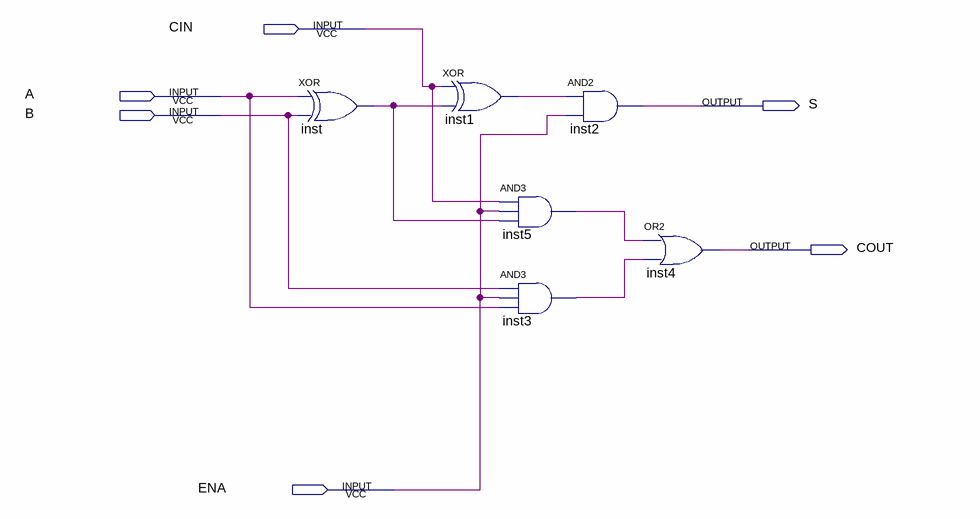
[diagram p0: schematic sheet]
// Quartus schematic FULL_ADDER_1BIT.bdf as structural Verilog: 6 symbols, 6 pins
module FULL_ADDER_1BIT (
  input  CIN,
  input  A,
  input  B,
  input  ENA,
  output S,
  output COUT
);

  wire inst1_out, inst3_out, inst5_out, inst_out;

  xor inst (inst_out, A, B);
  xor inst1 (inst1_out, CIN, inst_out);
  and inst5 (inst5_out, CIN, ENA, inst_out);
  and inst3 (inst3_out, B, ENA, A);
  and inst2 (S, inst1_out, ENA);
  or inst4 (COUT, inst5_out, inst3_out);
endmodule
